# EAGLE schematic ESP8266-programmer (EAGLE 7.5.0)
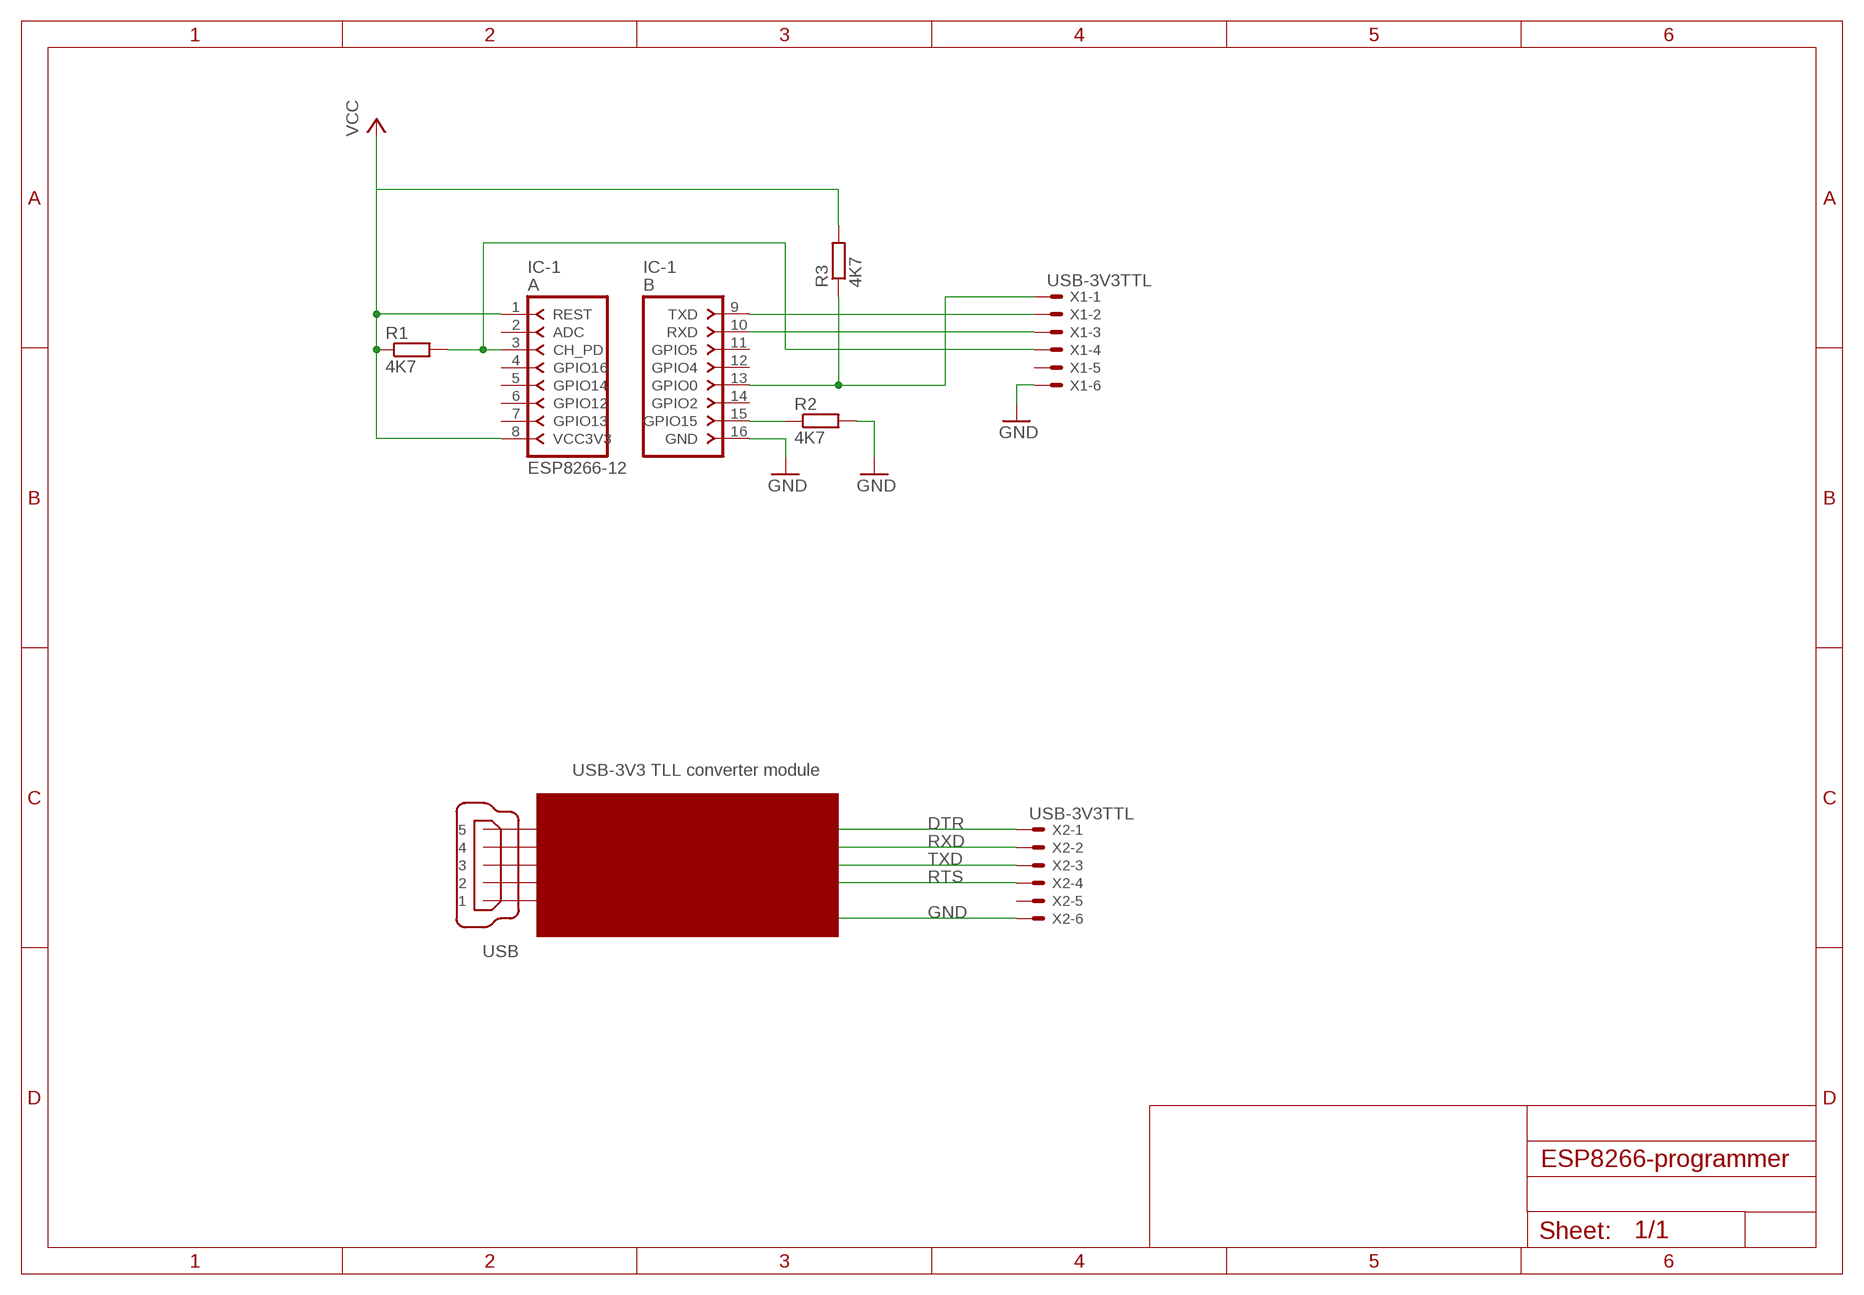
[diagram p0: schematic, sheet 1]

## Parts
IC-1  ESP8266-12  ESP8266-WITH-ADAPTER  [ESP8266-ADAPTER]
R1  4K7  R-EU_0207/10  [0207/10]
R2  4K7  R-EU_0207/10  [0207/10]
R3  4K7  R-EU_0207/10  [0207/10]
USB  MINI-USB-32005-301  [32005-301]
X1  USB-3V3TTL  22-23-2061  [22-23-2061]
X2  USB-3V3TTL  22-23-2061  [22-23-2061]

## Nets
GND: IC-1.16(GND) R2.2 X1.6
N$1: IC-1.13(GPIO0) R3.1 X1.1
N$2: IC-1.9(TXD) X1.2
N$3: IC-1.10(RXD) X1.3
N$4: IC-1.3(CH_PD) R1.2 X1.4
N$5: IC-1.15(GPIO15) R2.1
N$6: X2.1
N$7: X2.2
N$8: X2.3
N$9: X2.4
N$10: X2.6
VCC: IC-1.1(REST) IC-1.8(VCC3V3) R1.1 R3.2
Unconnected: IC-1.2(ADC) IC-1.4(GPIO16) IC-1.5(GPIO14) IC-1.6(GPIO12) IC-1.7(GPIO13) IC-1.11(GPIO5) IC-1.12(GPIO4) IC-1.14(GPIO2) USB.1 USB.2 USB.3 USB.4 USB.5 X1.5 X2.5

## Notes on the sheet
- USB-3V3 TLL converter module
- DTR
- RXD
- TXD
- RTS
- GND

## Library data of the parts
IC-1 = esp8266_with_adapter:ESP8266-WITH-ADAPTER: ESP8266 Adapter for ESP8266-03, ESP8266-04, ESP8266-07, ESP8266-08, ESP8266-12 and similar. (c) by Bartosz Batorek obi--wan@wp.pl
R1-R3 = resistor:R-EU_: RESISTOR, European symbol
USB = con-cypressindustries:MINI-USB-: MINI USB-B Conector Source: www.cypressindustries.com; OC_FARNELL: unknown; OC_NEWARK: unknown
X1 X2 = con-molex:22-23-2061: .100" (2.54mm) Center Header - 6 Pin; MF: MOLEX; MPN: 22-23-2061; OC_FARNELL: 1462922; OC_NEWARK: 27C1933